# Altium schematic sheet USB_HUB_6CH.SchDoc
size C; SheetNumber: 10; SheetTotal: 10
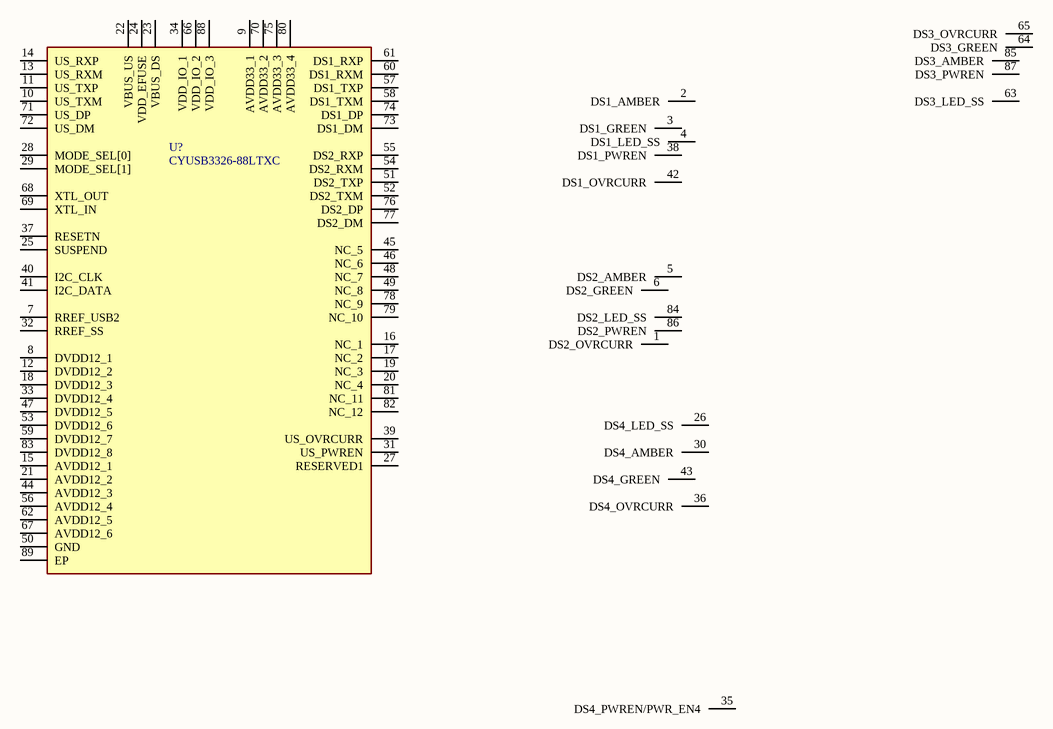
[diagram p0: USB_HUB_6CH.SchDoc]

## Parts
U?  CYUSB3326-88LTXC  [QFN40P1000X1000X100-89N-D]

## Nets

Not connected (* = marked no-connect by the designer): U? 1(DS2_OVRCURR) 2(DS1_AMBER) 3(DS1_GREEN) 4(DS1_LED_SS) 5(DS2_AMBER) 6(DS2_GREEN) 7(RREF_USB2) 8(DVDD12_1) 9(AVDD33_1) 10(US_TXM) 11(US_TXP) 12(DVDD12_2) 13(US_RXM) 14(US_RXP) 15(AVDD12_1) 16(NC_1) 17(NC_2) 18(DVDD12_3) 19(NC_3) 20(NC_4) 21(AVDD12_2) 22(VBUS_US) 23(VBUS_DS) 24(VDD_EFUSE) 25(SUSPEND) 26(DS4_LED_SS) 27(RESERVED1) 28(MODE_SEL[0]) 29(MODE_SEL[1]) 30(DS4_AMBER) 31(US_PWREN) 32(RREF_SS) 33(DVDD12_4) 34(VDD_IO_1) 35(DS4_PWREN/PWR_EN4) 36(DS4_OVRCURR) 37(RESETN) 38(DS1_PWREN) 39(US_OVRCURR) 40(I2C_CLK) 41(I2C_DATA) 42(DS1_OVRCURR) 43(DS4_GREEN) 44(AVDD12_3) 45(NC_5) 46(NC_6) 47(DVDD12_5) 48(NC_7) 49(NC_8) 50(GND) 51(DS2_TXP) 52(DS2_TXM) 53(DVDD12_6) 54(DS2_RXM) 55(DS2_RXP) 56(AVDD12_4) 57(DS1_TXP) 58(DS1_TXM) 59(DVDD12_7) 60(DS1_RXM) 61(DS1_RXP) 62(AVDD12_5) 63(DS3_LED_SS) 64(DS3_GREEN) 65(DS3_OVRCURR) 66(VDD_IO_2) 67(AVDD12_6) 68(XTL_OUT) 69(XTL_IN) 70(AVDD33_2) 71(US_DP) 72(US_DM) 73(DS1_DM) 74(DS1_DP) 75(AVDD33_3) 76(DS2_DP) 77(DS2_DM) 78(NC_9) 79(NC_10) 80(AVDD33_4) 81(NC_11) 82(NC_12) 83(DVDD12_8) 84(DS2_LED_SS) 85(DS3_AMBER) 86(DS2_PWREN) 87(DS3_PWREN) 88(VDD_IO_3) 89(EP)

## Library data of the parts
U? = CYUSB3326-88LTXC: Integrated Circuit; Manufacturer_Name: Cypress Semiconductor; Datasheet Link: https://www.cypress.com/file/141031/download; Height: 1mm; Manufacturer_Part_Number: CYUSB3326-88LTXC; Mouser Part Number: 727-CYUSB3326-88LTXC; Mouser Price/Stock: https://www.mouser.co.uk/ProductDetail/Cypress-Semiconductor/CYUSB3326-88LTXC?qs=E5eJzWX2jIBpFMiVHOq17A%3D%3D